# EAGLE design BATT_PINZA_DCDC_bot (EAGLE 9.6.2)
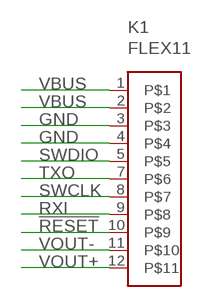
[diagram p0: schematic, sheet 1]

## Parts
K1  FLEX11  [FLEX11]

## Nets
!RESET: K1.10
GND: K1.3 K1.4
RXI: K1.9
SWCLK: K1.8
SWDIO: K1.5
TXO: K1.7
VBUS: K1.1 K1.2
VOUT+: K1.12
VOUT-: K1.11

## Library data of the parts
K1 = Flex_3mm:FLEX11

## Board
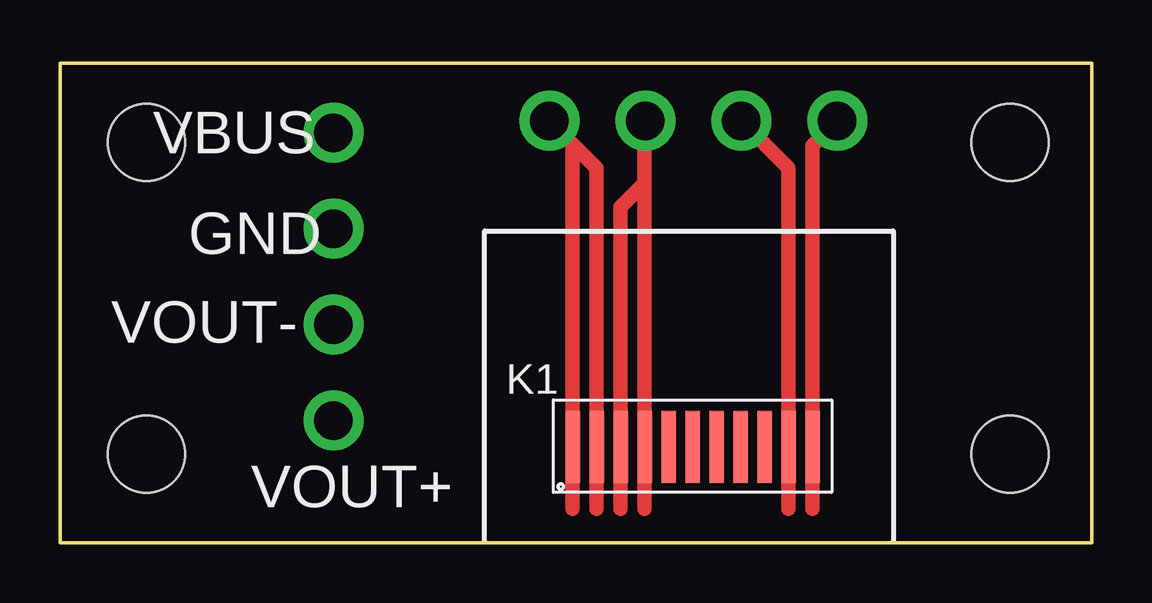
[diagram p1: board, top side]
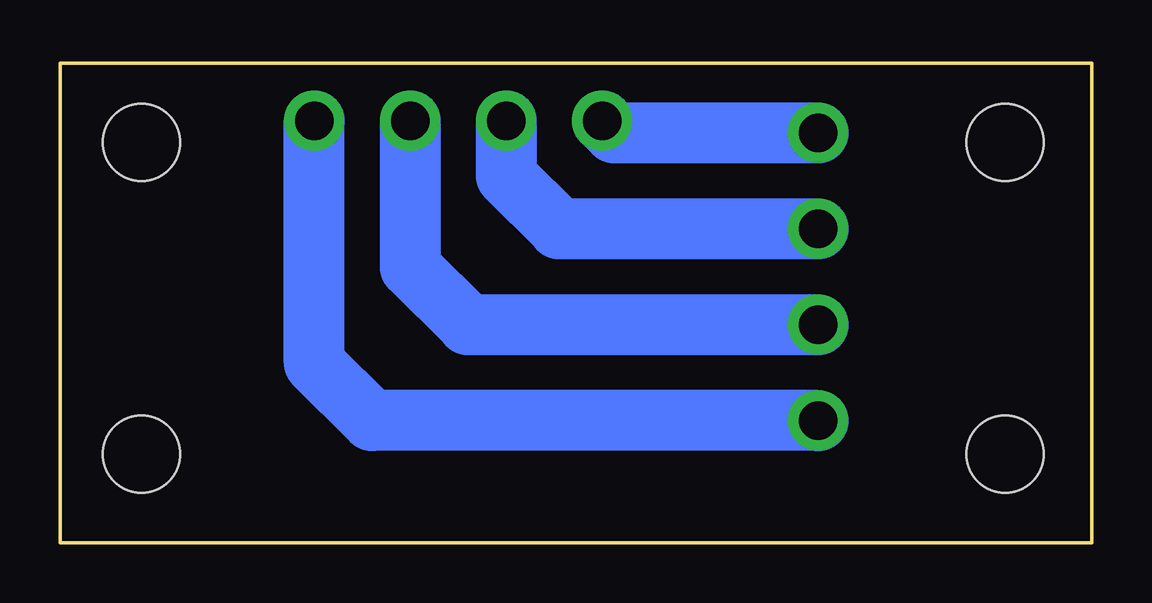
[diagram p2: board, bottom side, seen from below]

Size 43 x 20 mm. Coordinates in mm from the lower left corner, seen from the top.
Outline: 0,20 43,20 43,0 0,0 0,20
Copper layers (1*16): Top 0.035mm / dielectric 1.5mm / Bottom 0.035mm
Design rules "default": minimum track width 6mil, minimum drill 0.35mm, track to track 6mil, track to pad 6mil, pad to pad 6mil, via to via 6mil, smd to smd 6mil, copper to edge 40mil, drill to drill 6mil, minimum pad ring 10mil, minimum via ring 8mil, stop-mask expansion 4mil, vias tented up to drill 0mil, thermal gap 10mil
Holes 3.2 mm at 3.6,16.7 39.6,16.7 39.6,3.7 3.6,3.7

### Footprints (pad centres in the part's own frame; a part is rotated, then mirrored left to right if it is on the bottom)
FLEX11 = smd 0.6 x 3: 1 0.8,2.05; 2 1.8,2.05; 3 2.8,2.05; 4 3.8,2.05; 5 4.8,2.05; 7 5.8,2.05; 8 6.8,2.05; 9 7.8,2.05; 10 8.8,2.05; 11 9.8,2.05; 12 10.8,2.05

### Placement (x,y rotation side)
K1  20.57,1.95 0 top

### Tracks (layer width: path | path; a pad name or v marks a point on that pad's centre or on a via)
GND  (via drill 1.6 pad 2.5)
  Top 0.61: 24.37,15 K1.4 24.37,1.43 | 24.37,15 24.37,17.57 v24.4,17.6 | 24.37,15 23.37,14 K1.3 23.37,1.43
  Bottom 2.54: v24.4,17.6 24.4,15.3 22.2,13.1 v11.4,13.1
VBUS  (via drill 1.6 pad 2.5)
  Top 0.61: 21.37,16.63 K1.1 21.37,1.43 | 21.37,16.63 v20.4,17.6 | 21.37,16.63 22.37,15.63 K1.2 22.37,1.43
  Bottom 2.54: v20.4,17.6 19.9,17.1 v11.4,17.1
VOUT+  (via drill 1.6 pad 2.5)
  Top 0.61: v32.4,17.6 31.37,16.57 K1.12 31.37,1.43
  Bottom 2.54: v11.4,5.1 30,5.1 32.4,7.5 v32.4,17.6
VOUT-  (via drill 1.6 pad 2.5)
  Top 0.61: v28.4,17.6 30.37,15.63 K1.11 30.37,1.43
  Bottom 2.54: v28.4,17.6 28.4,11.5 26,9.1 v11.4,9.1

### Text on the board
tPlace: VBUS | GND | VOUT- | VOUT+